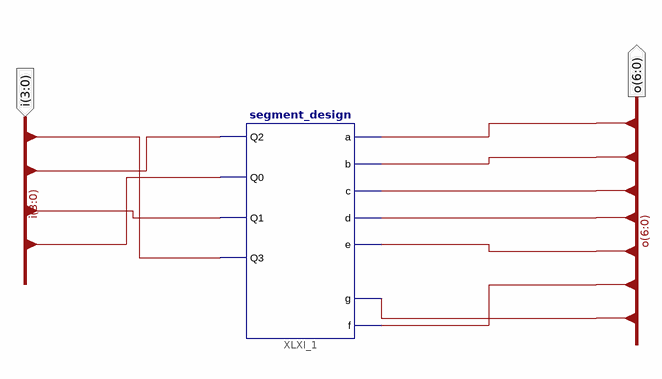
[diagram p0: schematic sheet 1]
// Xilinx ISE schematic segment_top.sch (spartan3) as structural Verilog: 1 symbols, 2 ports
module segment_top (
  input  [3:0] i,
  output [6:0] o
);

  segment_design XLXI_1 (
    .Q2(i[2]), .Q0(i[0]), .Q1(i[1]), .Q3(i[3]), .a(o[6]), .b(o[5]), .c(o[4]), .d(o[3]), .e(o[2]), .f(o[1]),
    .g(o[0]));
endmodule
